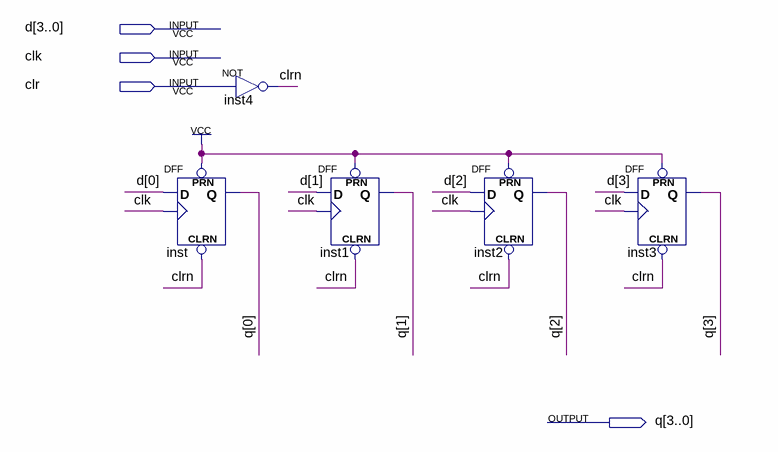
[diagram p0: schematic sheet]
// Quartus schematic registrador.bdf as structural Verilog: 5 symbols, 4 pins
module registrador (
  input  [3:0] d,
  input  clk,
  input  clr,
  output [3:0] q
);

  wire clrn;

  DFF inst (.CLRN(clrn), .CLK(clk), .D(d[0]), .PRN(1'b1), .Q(q[0]));
  not inst4 (clrn, clr);
  DFF inst1 (.CLRN(clrn), .CLK(clk), .D(d[1]), .PRN(1'b1), .Q(q[1]));
  DFF inst2 (.CLRN(clrn), .CLK(clk), .D(d[2]), .PRN(1'b1), .Q(q[2]));
  DFF inst3 (.CLRN(clrn), .CLK(clk), .D(d[3]), .PRN(1'b1), .Q(q[3]));
endmodule
